# EAGLE design fb_relais_8_230V_86 (EAGLE 7.4.0)
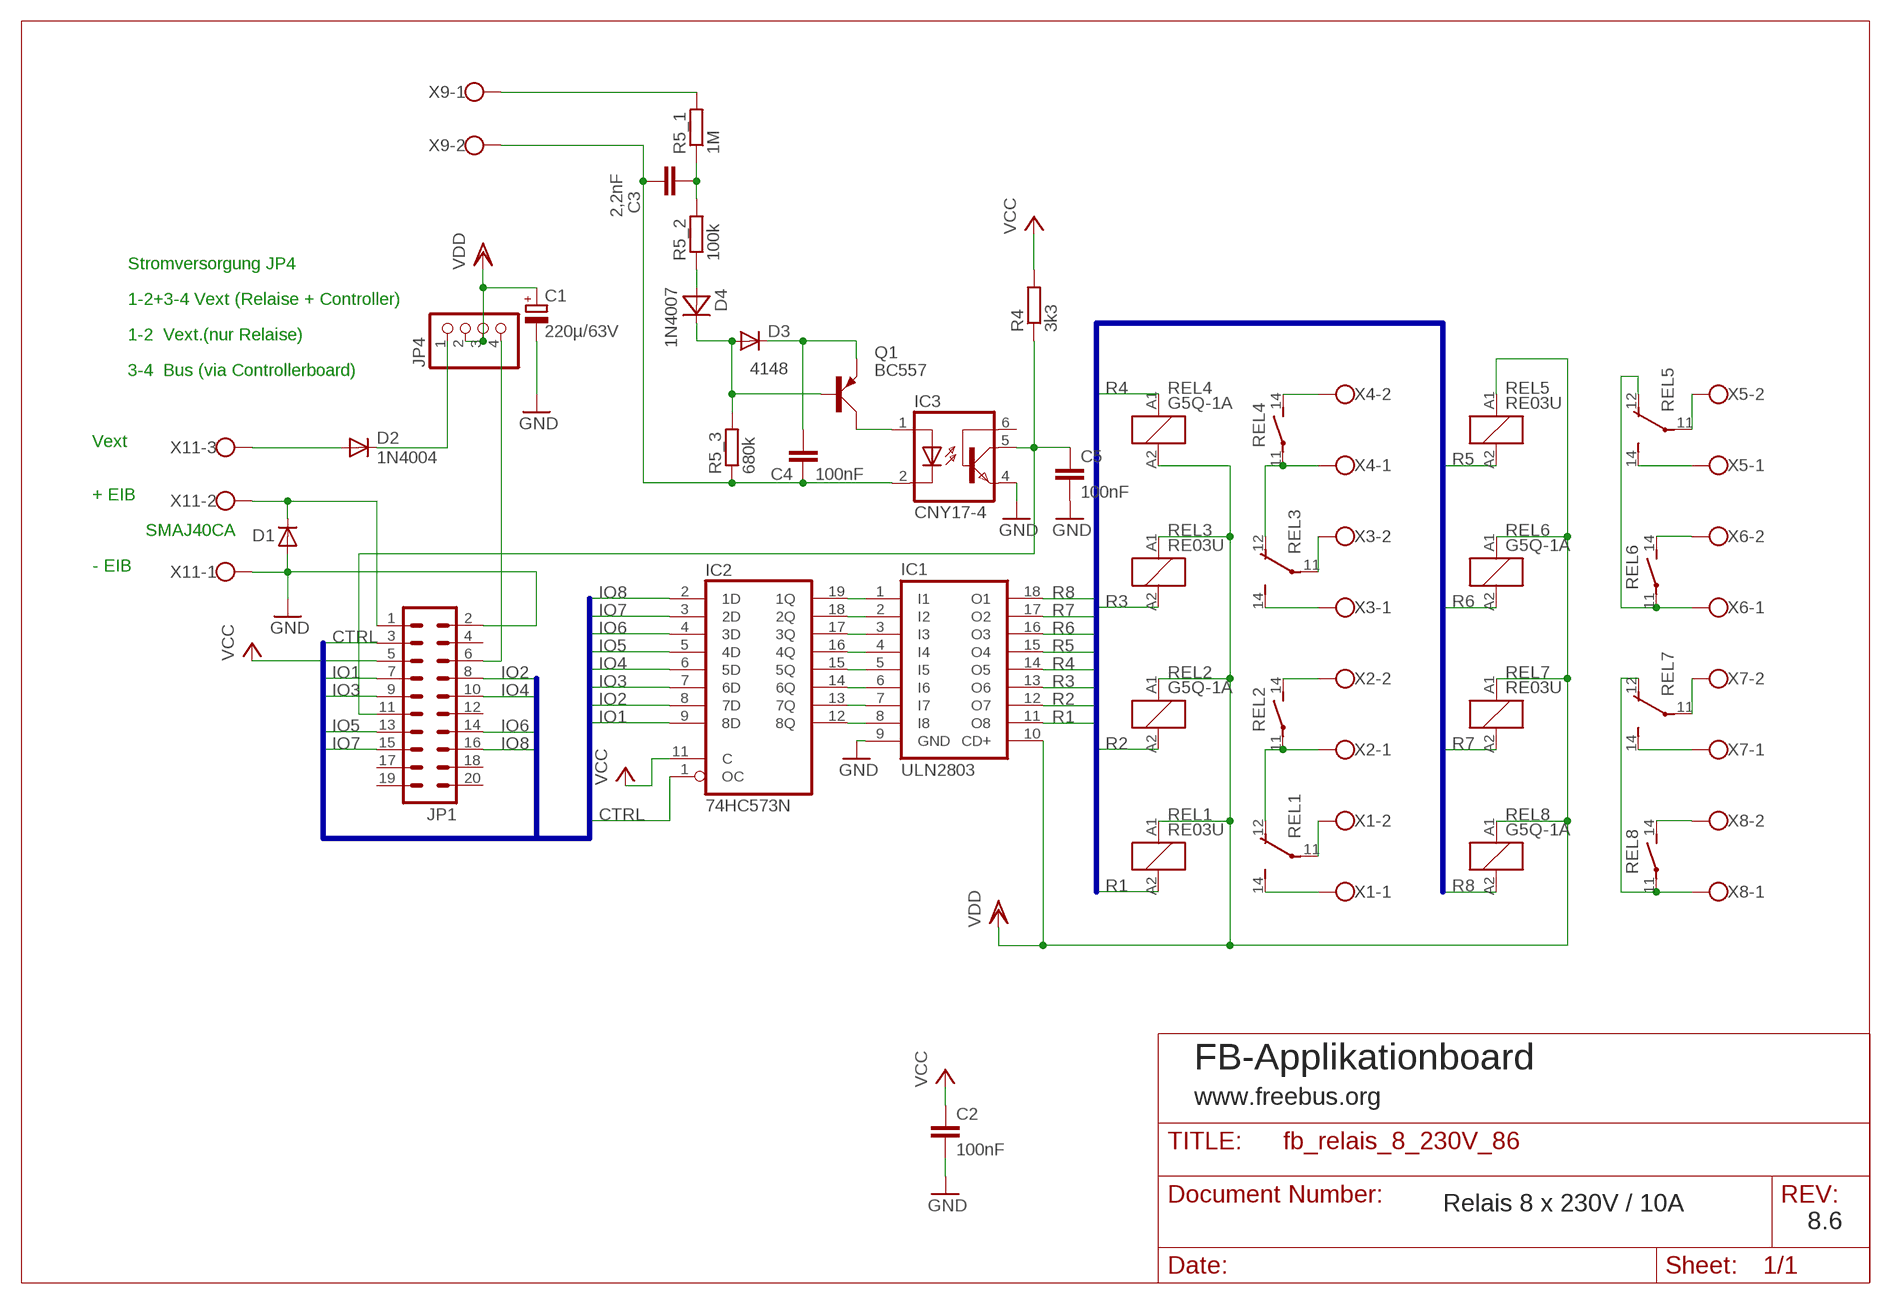
[diagram p0: schematic, sheet 1]

## Parts
C1  220µ/63V  CPOL-EUE5-10.5  [E5-10,5]
C2  100nF  C-EU050-024X044  [C050-024X044]
C3  2,2nF  C-EU102-043X133  [C102-043X133]
C4  100nF  C-EU050-024X044  [C050-024X044]
C5  100nF  C-EU050-024X044  [C050-024X044]
D1  D-SMB  [SMB]
D2  1N4004  [DO41-10]
D3  4148  1N41481448V  [D-2.5]
D4  1N4007  [DO41-7]
IC1  ULN2803  ULN2803A  [DIL18]
IC2  74HC573N  [DIL20]
IC3  CNY17-4  CNY17  [DIL06]
JP1  ML20  [ML20]
JP4  PINHD-1X4  [1X04]
Q1  BC557  [SOT54A]
R4  3k3  R-EU_0207/7  [0207/7]
R5_1  1M  R-EU_0207/7  [0207/7]
R5_2  100k  R-EU_0207/7  [0207/7]
R5_3  680k  R-EU_0207/7  [0207/7]
REL1  RE03U  [G5Q_1_EU]
REL2  G5Q-1A  RE030024  [RE-SCHRACK]
REL3  RE03U  [G5Q_1_EU]
REL4  G5Q-1A  RE030024  [RE-SCHRACK]
REL5  RE03U  [G5Q_1_EU]
REL6  G5Q-1A  RE030024  [RE-SCHRACK]
REL7  RE03U  [G5Q_1_EU]
REL8  G5Q-1A  RE030024  [RE-SCHRACK]
X1  W237-102  [W237-102]
X2  W237-102  [W237-102]
X3  W237-102  [W237-102]
X4  W237-102  [W237-102]
X5  W237-102  [W237-102]
X6  W237-102  [W237-102]
X7  W237-102  [W237-102]
X8  W237-102  [W237-102]
X9  W237-102  [W237-102]
X11  W237-3E  [W237-3E]

## Nets
CTRL: IC2.1(OC) JP1.3
GND: C1.- C2.2 C5.2 D1.2(A) IC1.9(GND) IC3.4(EMI) JP1.2 X11.1
IO1: IC2.9(8D) JP1.7
IO2: IC2.8(7D) JP1.8
IO3: IC2.7(6D) JP1.9
IO4: IC2.6(5D) JP1.10
IO5: IC2.5(4D) JP1.13
IO6: IC2.4(3D) JP1.14
IO7: IC2.3(2D) JP1.15
IO8: IC2.2(1D) JP1.16
N$1 [230Vac]: REL2.14(2:S) X2.2
N$2 [230Vac]: REL3.12(14:O) REL4.11(2:P) X4.1
N$3 [230Vac]: REL3.14(14:S) X3.1
N$4 [230Vac]: REL3.11(14:P) X3.2
N$5 [230Vac]: REL8.14(2:S) X8.2
N$6 [230Vac]: REL1.12(14:O) REL2.11(2:P) X2.1
N$7 [230Vac]: REL1.14(14:S) X1.1
N$8 [230Vac]: REL1.11(14:P) X1.2
N$9 [230Vac]: REL5.12(14:O) REL6.11(2:P) X6.1
N$10: REL5.14(14:S) X5.1
N$11 [230Vac]: REL7.11(14:P) X7.2
N$12 [230Vac]: REL6.14(2:S) X6.2
N$13 [230Vac]: REL5.11(14:P) X5.2
N$14: D2.A X11.3
N$15 [230Vac]: REL7.14(14:S) X7.1
N$16: R5_1.2 X9.1
N$17: D4.A R5_2.1
N$19: REL7.12(14:O) REL8.11(2:P) X8.1
N$20: D1.1(C) JP1.1 X11.2
N$25: D2.C JP4.1
N$27: IC3.1(A) Q1.C
N$28: C4.2 D3.C Q1.E
N$29: JP1.6 JP4.4
N$30: IC1.1(I1) IC2.19(1Q)
N$31: IC1.2(I2) IC2.18(2Q)
N$32: IC1.3(I3) IC2.17(3Q)
N$33: IC1.4(I4) IC2.16(4Q)
N$34: IC1.5(I5) IC2.15(5Q)
N$36: IC1.6(I6) IC2.14(6Q)
N$37: IC1.7(I7) IC2.13(7Q)
N$38: IC1.8(I8) IC2.12(8Q)
N$39 [230Vac]: REL4.14(2:S) X4.2
N$40: C3.2 C4.1 IC3.2(C) R5_3.1 X9.2
N$42: D3.A D4.C Q1.B R5_3.2
N$43: C5.1 IC3.5(COL) JP1.11 R4.1
N$45: C3.1 R5_1.1 R5_2.2
R1: IC1.11(O8) REL1.A2
R2: IC1.12(O7) REL2.A2
R3: IC1.13(O6) REL3.A2
R4: IC1.14(O5) REL4.A1
R5: IC1.15(O4) REL5.A2
R6: IC1.16(O3) REL6.A2
R7: IC1.17(O2) REL7.A2
R8: IC1.18(O1) REL8.A2
VCC: C2.1 IC2.11(C) JP1.5 R4.2
VDD: C1.+ IC1.10(CD+) JP4.2 JP4.3 REL1.A1 REL2.A1 REL3.A1 REL4.A2 REL5.A1 REL6.A1 REL7.A1 REL8.A1
Unconnected: IC3.6(BAS) JP1.4 JP1.12 JP1.17 JP1.18 JP1.19 JP1.20

## Buses
R[1..8]
IO[1..8],CTRL

## Notes on the sheet
- Stromversorgung JP4
- 1-2+3-4 Vext (Relaise + Controller)
- 1-2  Vext.(nur Relaise)
- 3-4  Bus (via Controllerboard)
- Vext
- + EIB
- SMAJ40CA
- - EIB
- FB-Applikationboard
- www.freebus.org
- Relais 8 x 230V / 10A
- 8.6

## Power pins joined to a net without a drawn wire
GND: IC2.10(GND)
VCC: IC2.20(VCC)

## Library data of the parts
C1 = rcl:CPOL-EU: POLARIZED CAPACITOR, European symbol
C2-C5 = rcl:C-EU: CAPACITOR, European symbol
D1 = semicon-smd-ipc:D-: DIODE unfilled
D2 = diode:1N4004: DIODE general purpose rectifier, 1 A
D3 = diode:1N4148: DIODE high speed (Philips)
D4 = diode:1N4007
IC1 = uln-udn:ULN2803A: DRIVER ARRAY
IC2 = 74xx-eu:74*573: 8-bit D latch BUS DRIVER
IC3 = optocoupler:CNY17: SIEMENS OPTO COUPLER
JP1 = con-harting-ml:ML20: HARTING
JP4 = pinhead:PINHD-1X4: PIN HEADER
Q1 = transistor-small-signal:BC557: PNP TRANSISTOR
R4 R5_1-R5_3 = rcl:R-EU_: RESISTOR, European symbol
REL1 REL3 REL5 REL7 = freebus_relay:RE03U
REL2 REL4 REL6 REL8 = relay:RE03*: Miniature PCB Relay 1 pole 6 A SCHRACK Source: http://www.schrack.com/.. 5812.pdf
X1-X9 = con-wago-500:W237-102: WAGO SCREW CLAMP
X11 = con-wago-508:W237-3E: WAGO SREW CLAMP

## Net classes
1 230Vac: width 1.93 mm, clearance 5.08 mm to class 0, clearance 1.905 mm

## Board
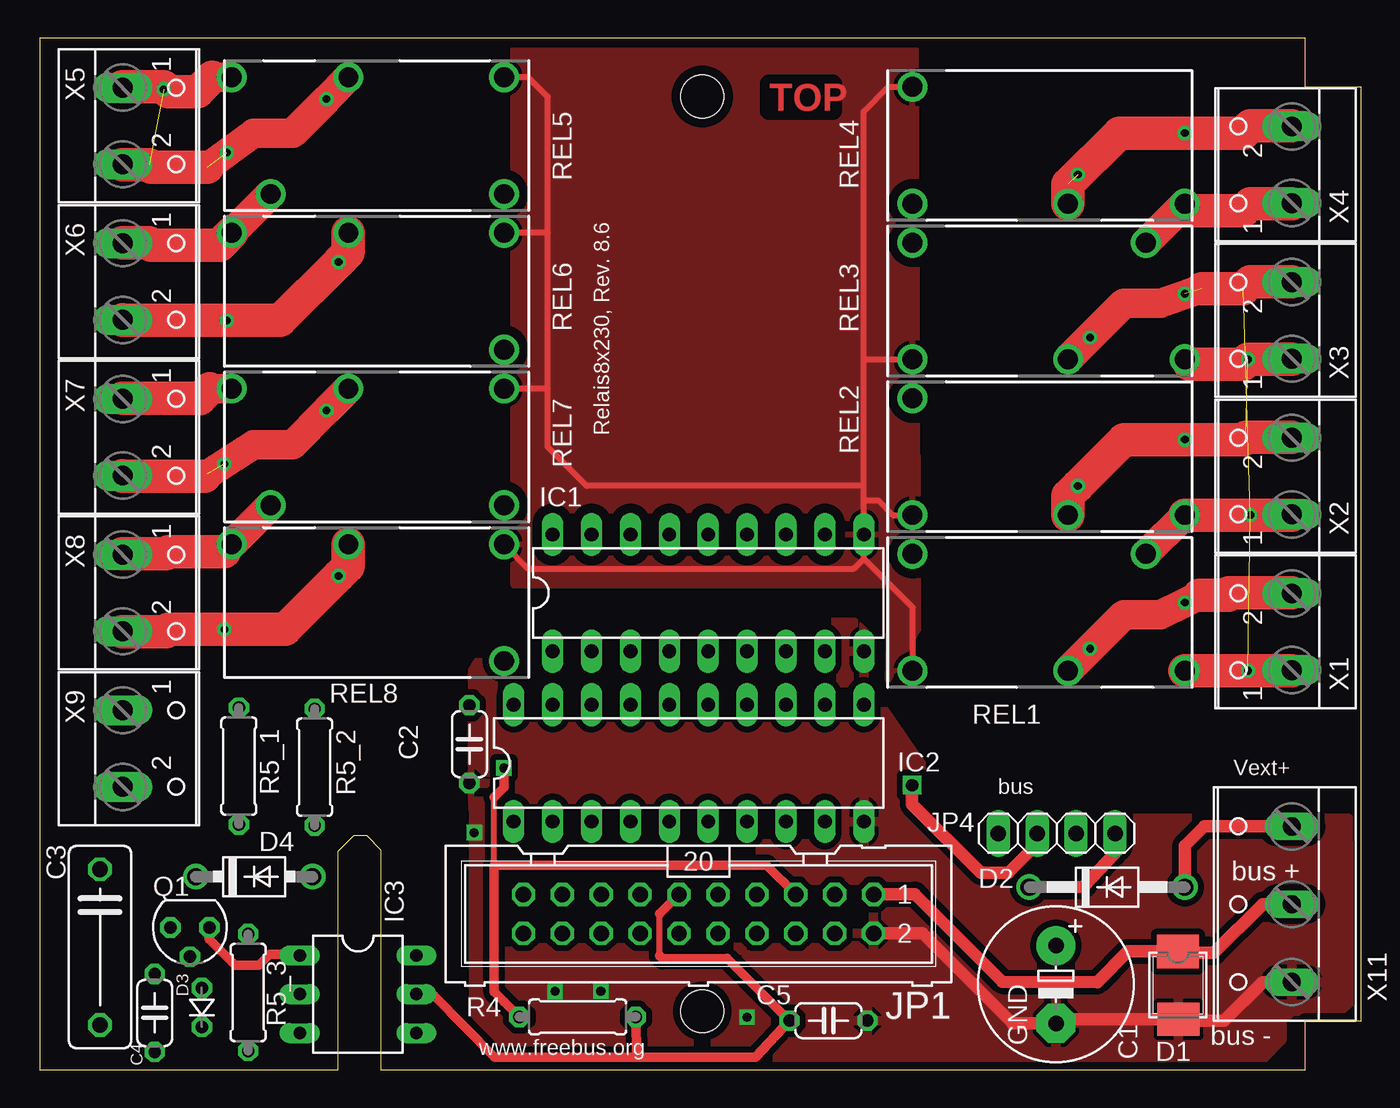
[diagram p1: board, top side]
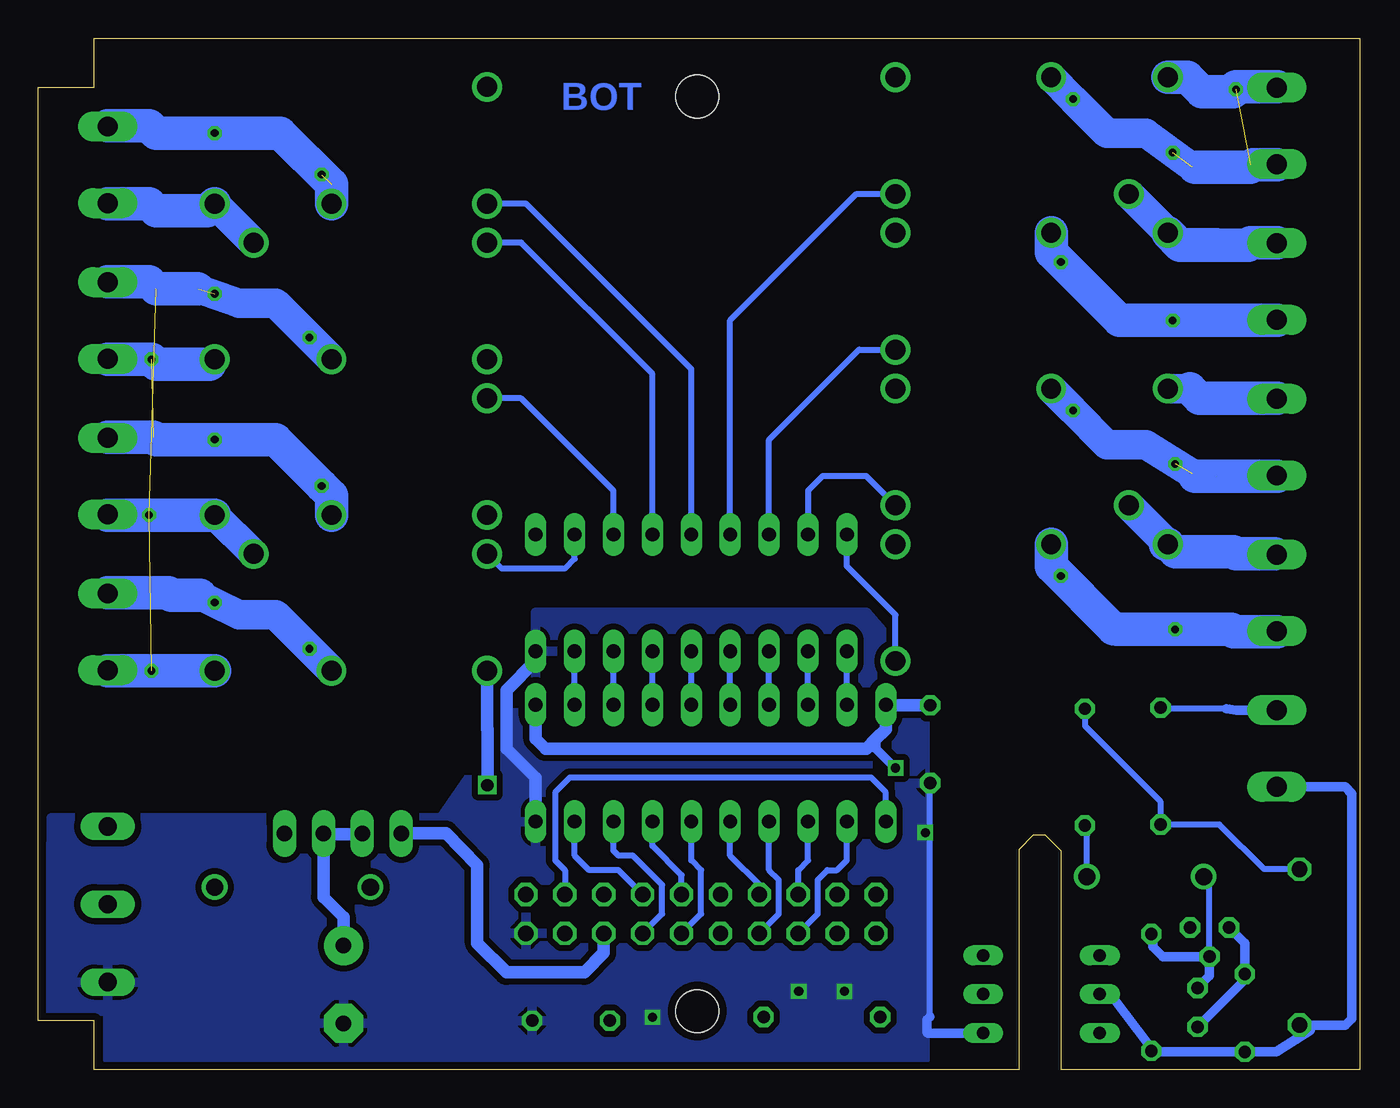
[diagram p2: board, bottom side, seen from below]

Size 86.28 x 67.3 mm. Coordinates in mm from the lower left corner, seen from the top.
Outline: 22.27,0 82.64,0 82.64,3.17 86.28,3.17 86.28,64.12 82.64,64.12 82.64,67.3 0,67.3 0,0 19.5,0 19.5,14.24 20.53,15.28 21.34,15.29 22.27,14.35 22.27,0
Copper layers (1*16): Top 0.035mm / dielectric 1.5mm / Bottom 0.035mm
Design rules "default": minimum track width 10mil, minimum drill 24mil, track to track 16mil, track to pad 12mil, pad to pad 16mil, via to via 16mil, smd to smd 8mil, copper to edge 20mil, drill to drill 10mil, minimum pad ring 10mil, minimum via ring 8mil, stop-mask expansion 4mil, vias tented up to drill 0mil, thermal gap 10mil
Holes 2.8 mm at 43.27,3.8 43.27,63.5

### Footprints (pad centres in the part's own frame; a part is rotated, then mirrored left to right if it is on the bottom)
E5-10,5 = drill 1.016 pad 2.54: + -2.54,0 | drill 1.016 pad 2.54 octagon: - 2.54,0
C050-024X044 = drill 0.813 octagon: 1 -2.54,0; 2 2.54,0
C102-043X133 = drill 1.016 octagon: 1 -5.08,0; 2 5.08,0
SMB = smd 2.159 x 2.743: 1 -2.311,-0.127; 2 2.108,-0.102
DO41-10 = drill 1.118: A 5.08,0; C -5.08,0
D-2.5 = drill 0.813 octagon: A 1.27,0; C -1.27,0
DO41-7 = drill 1.118: A 3.81,0; C -3.81,0
DIL18 = drill 0.9 long: 1 -10.16,-3.81; 2 -7.62,-3.81; 3 -5.08,-3.81; 4 -2.54,-3.81; 5 0,-3.81; 6 2.54,-3.81; 7 5.08,-3.81; 8 7.62,-3.81; 9 10.16,-3.81; 10 10.16,3.81; 11 7.62,3.81; 12 5.08,3.81; 13 2.54,3.81; 14 0,3.81; 15 -2.54,3.81; 16 -5.08,3.81; 17 -7.62,3.81; 18 -10.16,3.81
DIL20 = drill 0.9 long: 1 -11.43,-3.81; 2 -8.89,-3.81; 3 -6.35,-3.81; 4 -3.81,-3.81; 5 -1.27,-3.81; 6 1.27,-3.81; 7 3.81,-3.81; 8 6.35,-3.81; 9 8.89,-3.81; 10 11.43,-3.81; 11 11.43,3.81; 12 8.89,3.81; 13 6.35,3.81; 14 3.81,3.81; 15 1.27,3.81; 16 -1.27,3.81; 17 -3.81,3.81; 18 -6.35,3.81; 19 -8.89,3.81; 20 -11.43,3.81
DIL06 = drill 0.813 long: 1 -2.54,-3.81; 2 0,-3.81; 3 2.54,-3.81; 4 2.54,3.81; 5 0,3.81; 6 -2.54,3.81
ML20 = drill 1 octagon: 1 -11.43,-1.27; 2 -11.43,1.27; 3 -8.89,-1.27; 4 -8.89,1.27; 5 -6.35,-1.27; 6 -6.35,1.27; 7 -3.81,-1.27; 8 -3.81,1.27; 9 -1.27,-1.27; 10 -1.27,1.27; 11 1.27,-1.27; 12 1.27,1.27; 13 3.81,-1.27; 14 3.81,1.27; 15 6.35,-1.27; 16 6.35,1.27; 17 8.89,-1.27; 18 8.89,1.27; 19 11.43,-1.27; 20 11.43,1.27
1X04 = drill 1.016 long: 1 -3.81,0; 2 -1.27,0; 3 1.27,0; 4 3.81,0
SOT54A = drill 0.813 octagon: B 0,1.905; C -1.27,0; E 1.27,0
0207/7 = drill 0.813 octagon: 1 -3.81,0; 2 3.81,0
G5Q_1_EU = drill 1.3: 11 1.27,-3.81; 12 6.35,3.81; 14 8.89,-3.81; A1 -8.89,-3.81; A2 -8.89,3.81
RE-SCHRACK = drill 1.3: 11 8.89,-3.81; 14 1.27,-3.81; A1 -8.89,-3.81; A2 -8.89,3.81
W237-102 = drill 1.3 long: 1 -2.5,-1.27; 2 2.5,-1.27
W237-3E = drill 1.194 long: 1 -5.08,-0.635; 2 0,-0.635; 3 5.08,-0.635

### Placement (x,y rotation side)
C1  66.35,5.55 270 top
C2  28.06,21.24 270 top
C3  3.94,7.99 270 top
C4  7.51,3.69 90 top
C5  51.5,3.19 0 top
D1  74.45,5.39 270 top
D2  69.69,11.91 0 top
D3  10.59,4.06 90 top
D4  14.01,12.59 0 top
IC1  43.65,31.11 0 top
IC2  42.38,20 0 top
IC3  20.79,4.92 270 top
JP1  43.02,10.16 180 top
JP4  66.4,15.41 180 top
Q1  9.81,9.27 180 top
R4  35.12,3.43 180 top
R5_1  13.01,19.8 90 top
R5_2  17.95,19.74 90 top
R5_3  13.61,5.03 90 top
REL1  65.88,29.84 0 top
REL2  65.88,40 0 top
REL3  65.88,50.16 0 top
REL4  65.88,60.32 0 top
REL5  21.42,60.96 180 top
REL6  21.42,50.8 180 top
REL7  21.42,40.64 180 top
REL8  21.42,30.47 180 top
X1  80.48,28.57 90 top
X2  80.48,38.73 90 top
X3  80.48,48.89 90 top
X4  80.48,59.05 90 top
X5  6.69,61.59 270 top
X6  6.69,51.43 270 top
X7  6.69,41.27 270 top
X8  6.69,31.11 270 top
X9  6.69,20.95 270 top
X11  81.11,10.79 90 top

### Tracks (layer width: path | path; a pad name or v marks a point on that pad's centre or on a via)
CTRL
  Bottom 0.406: IC2.1 30.95,18.09 31.9,19.04 51.59,19.04 52.54,18.09 52.54,13.65 51.91,13.01 JP1.3
GND  (via drill 0.6)
  Top 0.813: X11.1 79.84,5.71 77.3,3.17 74.46,3.17 D1.2 66.62,3.28 C1.- | 66.03,3.01 63.49,3.01 57.62,8.89 JP1.2
  Bottom 0.406: 28.06,3.46 C2.2
  Bottom 0.61: IC3.4 28.21,2.38 28.27,2.44 28.27,3.25 28.06,3.46
  Bottom 0.813: C1.- 66.03,3.01 | IC1.9 53.81,26.66 55.71,24.76 55.71,20.95 53.81,19.04 IC2.10
  other vias: 33.65,5.1 28.37,15.46 36.64,5.11 46.18,3.41
  pour Top: 28.33,4.52 28.33,16.58 28.25,17.77 28.25,26.03 30.31,29.2 53.17,29.2 53.81,28.57 53.81,25.39 60.03,16.41 85.43,16.41 85.56,4.44 84.92,3.8 81.75,3.8 81.11,3.17 81.11,1.9 79.84,0.63 28.41,0.55
  pour Bottom: 28.41,0.63 81.75,0.63 81.75,3.8 85.56,3.8 85.43,16.42 60.03,16.42 53.81,25.39 53.81,29.84 32.22,29.84 28.41,25.39
IO1
  Bottom 0.406: JP1.7 48.41,13.01 50.32,13.01 51.27,13.97 IC2.9
IO2
  Bottom 0.406: JP1.8 45.55,10.16 45.55,12.06 47.46,13.97 48.41,13.97 48.73,14.28 IC2.8
IO3
  Bottom 0.406: JP1.9 44.28,12.7 46.19,14.6 IC2.7
IO4
  Bottom 0.406: JP1.10 43.02,10.16 43.02,13.01 43.65,13.65 IC2.6
IO5
  Bottom 0.406: JP1.13 39.2,12.06 41.11,13.97 IC2.5
IO6
  Bottom 0.406: JP1.14 37.94,10.16 37.94,12.38 38.57,13.01 IC2.4
IO7
  Bottom 0.406: JP1.15 36.66,13.01 36.03,13.65 IC2.3
IO8
  Bottom 0.406: JP1.16 35.39,10.16 35.39,12.38 34.76,13.01 34.12,13.01 33.49,13.65 IC2.2
N$1  (via drill 0.5)  (1 unrouted)
  Top 1.93: 81.75,41.27 X2.2
  Top 2.184: REL2.14 67.14,37.46 v67.78,38.1 70.8,41.11 v74.77,41.11 78.58,41.11 78.73,41.27 81.75,41.27
  Bottom 1.93: 77.46,41.11 77.5,41.08 | X2.2 81.75,41.27
  Bottom 2.184: REL2.14 67.14,37.46 v67.78,38.1 70.8,41.11 v74.77,41.11 77.46,41.11 | 77.62,41.11 78.58,41.11 78.73,41.27 81.75,41.27
  other vias: 78.89,46.35
N$2
  Top 1.93: REL3.12 REL4.11 75.24,56.03 | 77.56,56.03 77.62,56.03 | 81.75,56.51 X4.1
  Top 2.184: 75.24,56.03 77.56,56.03 78.58,56.03 79.05,56.51 81.75,56.51
  Bottom 1.93: REL3.12 REL4.11
  Bottom 2.184: REL4.11 75.24,56.03 78.58,56.03 79.05,56.51 81.75,56.51
N$3  (1 unrouted)
  Top 1.93: 75.08,46.03 REL3.14 | 81.75,46.35 X3.1
  Top 2.184: 78.58,46.03 78.89,46.35 81.75,46.35 | 75.08,46.03 78.42,46.03
  Bottom 1.93: REL3.14 75.08,46.03
  Bottom 2.184: 75.08,46.03 78.58,46.03 78.89,46.35 81.75,46.35
N$4  (via drill 0.5)  (3 unrouted)
  Top 1.93: REL3.11 v68.57,47.78 70.8,50 73.18,50 75.88,50.95 | 81.75,51.43 X3.2
  Top 2.184: 75.88,50.95 78.58,50.95 79.05,51.43 81.75,51.43
  Bottom 1.93: REL3.11 v68.57,47.78 70.8,50 73.18,50 75.88,50.95
  Bottom 2.184: 75.88,50.95 78.58,50.95 79.05,51.43 81.75,51.43
  other vias: 74.77,50.64 79.05,36.19 78.89,26.03
N$5  (via drill 0.5)
  Top 1.93: 5.39,28.57 X8.2
  Top 2.184: REL8.14 20.15,32.86 v19.52,32.22 16.03,28.73 v12.06,28.73 8.41,28.73 8.25,28.57 5.39,28.57
  Bottom 1.93: 5.39,28.57 X8.2
  Bottom 2.184: 16.08,28.78 20.15,32.86 REL8.14 | 9.36,28.73 8.41,28.73 8.25,28.57 5.39,28.57
N$6
  Top 1.93: REL1.12 REL2.11 | X2.1 81.75,36.19 | 78.58,36.19 78.73,36.19
  Top 2.184: REL2.11 77.61,36.19 | 77.61,36.19 77.62,36.19 | 77.61,36.19 78.58,36.19 | 78.73,36.19 81.75,36.19
  Bottom 1.93: REL1.12 REL2.11 | 81.75,36.19 X2.1
  Bottom 2.184: REL2.11 81.75,36.19
N$7
  Top 1.93: 77.56,26.03 77.62,26.03 | 81.75,26.03 X1.1
  Top 2.184: REL1.14 77.56,26.03 81.75,26.03
  Bottom 2.184: REL1.14 81.75,26.03
N$8  (via drill 0.5)
  Top 1.93: REL1.11 v68.57,27.46 70.8,29.68 73.02,29.68 | X1.2 81.75,31.11 | 75.72,30.95 v74.77,30.47 73.18,29.68 | 77.56,31.01 77.62,30.95
  Top 2.184: 81.75,31.11 77.64,31.11 | 75.72,30.95 77.62,30.95
  Bottom 1.93: REL1.11 v68.57,27.46 70.8,29.68 73.18,29.68 v74.77,30.47 75.72,30.95 | 81.75,31.11 X1.2
  Bottom 2.184: 75.72,30.95 77.62,30.95 77.78,31.11 81.75,31.11
N$9  (1 unrouted)
  Top 1.93: REL5.12 REL6.11 11.9,53.97 | 5.39,53.97 5.39,53.96 X6.1 | 9.36,53.81 9.36,53.85
  Top 2.184: 9.33,53.81 7.3,53.81 7.14,53.97 5.39,53.97 | 9.36,53.81 11.74,53.81 REL6.11
  Bottom 1.93: REL6.11 REL5.12 | 9.36,53.91 9.36,53.97 11.58,53.97 11.74,53.81
  Bottom 2.184: 5.39,53.97 7.14,53.97 7.3,53.81 11.74,53.81 REL6.11
N$10
  Top 1.93: 11.27,64.77 REL5.14 | 5.39,64.13 X5.1
  Top 2.184: 11.27,64.77 10.31,63.81 8.41,63.81 8.09,64.13 5.39,64.13
  Bottom 2.184: 5.39,64.13 8.09,64.13 8.25,63.97 8.25,63.81 10.31,63.81 11.27,64.77 REL5.14
N$11  (via drill 0.5)  (2 unrouted)
  Top 1.93: REL7.11 v18.73,43.02 16.5,40.79 13.96,40.79 10.79,38.73 | 9.36,38.73 9.36,38.75 | 5.39,38.74 5.39,38.73
  Top 2.184: 10.79,38.73 9.36,38.73 5.39,38.73 | X7.2 5.39,38.74
  Bottom 1.93: REL7.11 v18.73,43.02 16.5,40.79 13.96,40.79 10.95,38.89 10.79,38.73 | 9.36,38.73 9.36,38.75
  Bottom 2.184: 10.79,38.73 9.36,38.73 5.39,38.73
  other vias: 12.06,39.52
N$12  (via drill 0.5)
  Top 1.93: 9.38,48.89 9.36,48.89 | 5.39,48.9 5.39,48.89
  Top 2.184: REL6.14 20.15,53.34 v19.52,52.7 15.71,48.89 v12.22,48.89 9.38,48.89 5.39,48.89 | X6.2 5.39,48.9
  Bottom 2.184: REL6.14 20.15,53.34 15.71,48.89 v12.22,48.89 5.39,48.89
N$13  (via drill 0.5)  (2 unrouted)
  Top 1.93: REL5.11 v18.73,63.34 16.5,61.11 13.96,61.11 10.95,58.89 | 5.39,59.05 5.39,59.06 X5.2
  Top 2.184: 10.95,58.89 7.3,58.89 7.14,59.05 5.39,59.05
  Bottom 1.93: 10.79,58.88 10.94,58.88 | REL5.11 v18.73,63.34 16.5,61.11 13.96,61.11 10.95,58.89 10.79,58.89 10.79,58.88 | 10.79,58.88 10.78,58.89
  Bottom 2.184: 10.78,58.89 9.38,58.89 7.14,58.89 6.98,59.05 5.39,59.05
  other vias: 12.22,59.84 8.09,63.97
N$14
  Top 0.813: X11.3 76.03,15.87 74.77,14.6 D2.A
N$15
  Top 1.93: REL7.14 11.11,44.45 | 9.37,43.81 9.36,43.81 | 5.39,43.81 5.39,43.8 X7.1
  Top 2.184: 10.44,43.78 10.41,43.81 10.31,43.81 | 10.31,43.81 9.37,43.81 5.39,43.81 | 10.31,43.81 10.47,43.81 11.11,44.45
  Bottom 1.93: 11.11,44.45 REL7.14 | 5.39,43.81 5.39,43.8 X7.1
  Bottom 2.184: 11.11,44.45 10.47,43.81 5.39,43.81
N$16
  Bottom 0.406: 8.73,23.54 12.94,23.54 R5_1.2
  Bottom 0.61: X9.1 8.05,23.45 8.73,23.54
N$17
  Bottom 0.406: D4.A 17.82,15.32 R5_2.1
N$19
  Top 1.93: 12.06,33.81 REL7.12 | 5.39,33.65 5.39,33.64 X8.1
  Top 2.184: 12.06,33.81 8.41,33.81 8.25,33.65 5.39,33.65
  Bottom 1.93: REL7.12 REL8.11
  Bottom 2.184: 5.55,33.65 8.09,33.65 8.25,33.81 12.06,33.81 | 12.06,33.81 12.03,33.78 | 12.06,33.81 REL8.11 12.69,34.29
N$20
  Top 0.813: X11.2 79.84,10.79 76.67,7.62 74.41,7.62 D1.1 71.04,7.7 69.05,5.71 62.87,5.74 57.15,11.46 JP1.1
N$24
  Bottom 2.184: 9.52,28.73 15.87,28.73
N$25
  Top 0.813: D2.C 68.14,11.93 70.16,14.07 70.22,15.06 JP4.1
N$27
  Top 0.61: Q1.C 11.08,8.49 12.75,6.82 14.3,6.82 15,7.52 16.92,7.52 IC3.1
N$28
  Bottom 0.61: Q1.E 7.51,8.24 C4.2 7.51,5.87 D3.C
N$29
  Bottom 0.813: JP4.4 59.67,15.43 57.62,13.33 57.62,8.25 55.71,6.34 50.63,6.34 49.37,7.62 JP1.6
N$30
  Bottom 0.406: IC2.19 IC1.1
N$31
  Bottom 0.406: IC2.18 IC1.2
N$32
  Bottom 0.406: IC2.17 IC1.3
N$33
  Bottom 0.406: IC2.16 IC1.4
N$34
  Bottom 0.406: IC2.15 IC1.5
N$36
  Bottom 0.406: IC2.14 IC1.6
N$37
  Bottom 0.406: IC2.13 IC1.7
N$38
  Bottom 0.406: IC2.12 IC1.8
N$39  (via drill 0.5)  (1 unrouted)
  Top 1.93: 81.75,61.59 X4.2
  Top 2.184: REL4.14 67.14,57.78 70.48,61.11 v74.77,61.11 78.58,61.11 79.05,61.59 81.75,61.59
  Bottom 1.93: X4.2 81.75,61.59
  Bottom 2.184: REL4.14 67.14,57.78 70.48,61.11 v74.77,61.11 77.48,61.11 | 77.62,61.11 78.58,61.11 79.05,61.59 81.75,61.59
  other vias: 67.78,58.41
N$40
  Bottom 0.61: X9.2 0.96,18.45 0.52,18.01 0.52,3.32 0.95,2.89 3.21,2.89 C3.2 3.23,2.55 5.44,1.17 7.49,1.17 C4.1 13.54,1.15 R5_3.1 13.61,1.39 16.27,4.88 16.94,4.88 IC3.2
N$42
  Bottom 0.406: Q1.B 9.81,12.38 D4.C
  Bottom 0.61: D3.A 9.81,6.11 Q1.B 12.87,7.37 13.5,8 13.5,8.73 R5_3.2
N$43
  Top 0.406: 40.48,7.42 40.48,10.16 | R4.1 38.95,3.43
  Top 0.61: 40.48,10.16 JP1.11 | IC3.5 24.69,4.83 25.74,4.83 29.7,0.81 38.97,0.8 | 38.97,0.8 46.74,0.79 C5.1 45.47,6.68 44.86,7.26 40.66,7.24 40.48,7.42 | 38.95,3.43 38.97,0.8
N$45
  Bottom 0.406: R5_2.2 17.95,22.43 13.04,17.52 13.04,16.03 R5_1.1 9.16,15.99 6.24,13.07 C3.1
R1
  Bottom 0.406: REL1.A2 56.03,32.7 51.91,32.7 51.27,33.33 IC1.11
R2
  Bottom 0.406: IC1.12 48.73,37.78 54.76,43.81 REL2.A2
R3
  Bottom 0.406: IC1.13 46.19,45.4 54.76,53.97 REL3.A2
R4
  Bottom 0.406: IC1.14 43.65,45.72 54.45,56.51 REL4.A1
R5
  Bottom 0.406: IC1.15 41.11,48.89 32.85,57.15 REL5.A2
R6
  Bottom 0.406: IC1.16 38.57,41.11 32.7,46.98 REL6.A2
R7
  Bottom 0.406: IC1.17 36.03,37.78 35.08,38.73 32.22,38.73 REL7.A2
R8
  Bottom 0.406: REL8.A2 30.31,29.68 33.49,32.86 IC1.18
VCC  (via drill 0.6)
  Top 0.406: 29.68,13.33 29.68,17.77 | R4.2 31.31,3.44
  Top 0.61: JP1.5 47.46,13.33 29.68,13.33 29.68,5.08 30.31,4.44 31.31,3.44 | 29.68,17.77 30.31,18.41 v30.31,19.68
  Bottom 0.61: v30.31,19.68 31.58,20.95 31.58,21.58
  Bottom 0.813: C2.1 30.92,23.78 IC2.20 30.95,22.22 31.58,21.58 32.22,20.95 53.17,20.95 53.81,21.58 IC2.11
VDD  (via drill 0.8)
  Top 0.406: REL5.A1 31.9,64.77 33.17,63.5 33.17,54.61 | 33.17,54.61 REL6.A1 | 33.17,44.45 33.17,54.61 | 33.17,44.45 REL7.A1 | REL8.A1 31.9,32.7 53.17,32.7 53.81,33.33 | 53.81,33.33 IC1.10 53.81,37.14 | REL1.A1 56.98,30.16 53.81,33.33 | 53.81,37.14 53.81,38.1 | 53.81,38.1 53.81,46.35 | 53.81,46.35 53.81,62.54 55.4,64.13 REL4.A2 | REL2.A1 55.71,36.19 54.76,37.14 53.81,37.14 | 53.81,46.35 REL3.A1 | 33.17,44.45 33.17,40.64 35.71,38.1 53.81,38.1
  Top 0.813: v56.96,18.56 56.96,17.33 61.44,12.85 63.25,12.85 65.11,14.71 65.11,15.39 JP4.3
  Bottom 0.813: C1.+ 66.35,9.95 67.66,11.26 67.67,15.35 | 67.67,15.35 JP4.2 | 67.67,15.35 65.45,15.35 JP4.3 | REL1.A1 56.98,22.22 56.96,22.22 v56.96,18.56
  pour Top (isolate 0.61): 30.95,66.67 57.18,66.67 57.35,28.72 55.4,25.39 55.56,31.59 30.95,31.59

### Text on the board
Top: TOP
Bottom: BOT
tPlace: Vext+ | bus | bus + | bus -
tNames: REL4 | Relais8x230, Rev. 8.6 | GND | www.freebus.org
Document: A5 | A4 | A6 | A3 | A7 | A2 | A8 | A1 | EIB + | Vext+ | EIB - | Vext-
tDocu: L-detect | N
Drill_legend: Bohrlegende | Datum: 10.01.2009 22:11:37 | 2.8000 mm / 110.236 mil | 1.6000 mm / 62.992 mil | 1.3000 mm / 51.181 mil | 1.2000 mm / 47.244 mil | 1.1000 mm / 43.307 mil | 1.0000 mm / 39.370 mil | 0.9000 mm / 35.433 mil | 0.5000 mm / 19.685 mil